# EAGLE design rfm_dil_adapter (EAGLE 6.6.0)
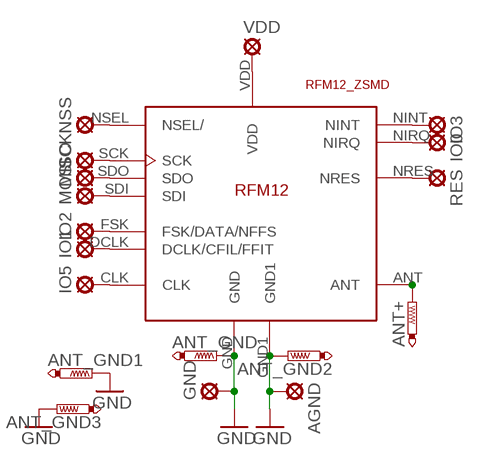
[diagram p0: schematic, sheet 1]

## Parts
AGND  LSP10  [LSP10]
ANT+  PTR1TP20SQ  [TP20SQ]
ANT_GND  PTR1TP20SQ  [TP20SQ]
ANT_GND1  PTR1TP20SQ  [TP20SQ]
ANT_GND2  PTR1TP20SQ  [TP20SQ]
ANT_GND3  PTR1TP20SQ  [TP20SQ]
GND  LSP10  [LSP10]
IO0  LSP10  [LSP10]
IO1  LSP10  [LSP10]
IO2  LSP10  [LSP10]
IO3  LSP10  [LSP10]
IO5  LSP10  [LSP10]
MISO  LSP10  [LSP10]
MOSI  LSP10  [LSP10]
NSS  LSP10  [LSP10]
RES  LSP10  [LSP10]
SCK  LSP10  [LSP10]
U$1  RFM12_ZSMD  [RFM12_Z]
VDD  LSP10  [LSP10]

## Nets
ANT: ANT+.TP U$1.ANT
GND: AGND.MP ANT_GND1.TP ANT_GND2.TP ANT_GND3.TP ANT_GND.TP GND.MP U$1.GND U$1.GND1
N$1: IO5.MP U$1.CLK
N$2: IO1.MP U$1.DCLK(DCLK/CFIL/FFIT)
N$3: IO2.MP U$1.FSK(FSK/DATA/NFFS)
N$4: MOSI.MP U$1.SDI
N$5: MISO.MP U$1.SDO
N$6: SCK.MP U$1.SCK
N$7: NSS.MP U$1.NSEL(NSEL/)
N$11: RES.MP U$1.NRES
N$12: IO0.MP U$1.NIRQ
N$13: IO3.MP U$1.NINT
VDD: U$1.VDD VDD.MP

## Library data of the parts
AGND GND IO0 IO1-IO3 IO5 MISO MOSI NSS RES SCK VDD = solpad:LSP10: SOLDER PAD drill 1.0 mm, distributor Buerklin, 12H555
ANT+ ANT_GND ANT_GND1-ANT_GND3 = testpad:PTR1: TEST PIN
U$1 = fp:RFM12_Z

## Board
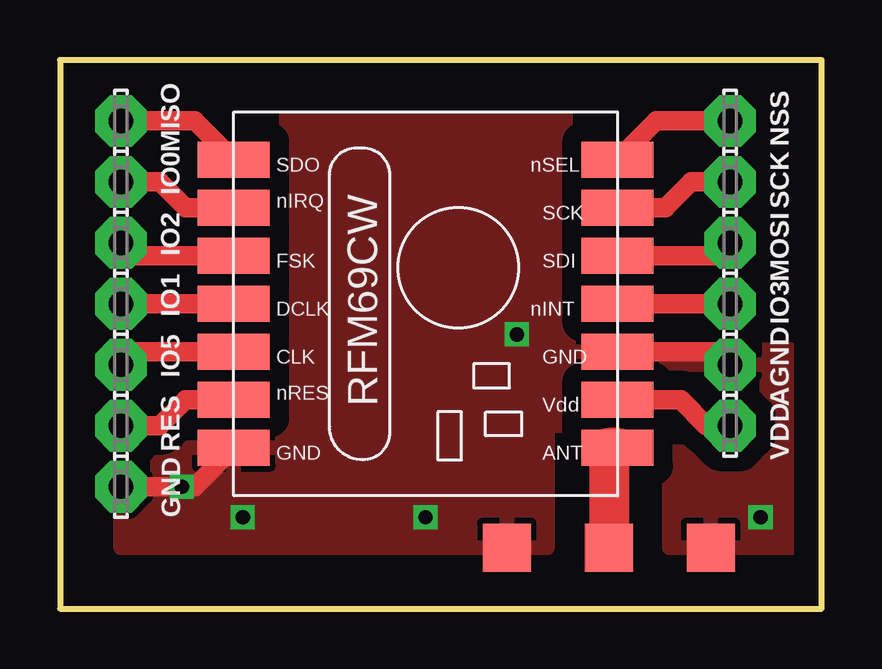
[diagram p1: board, top side]
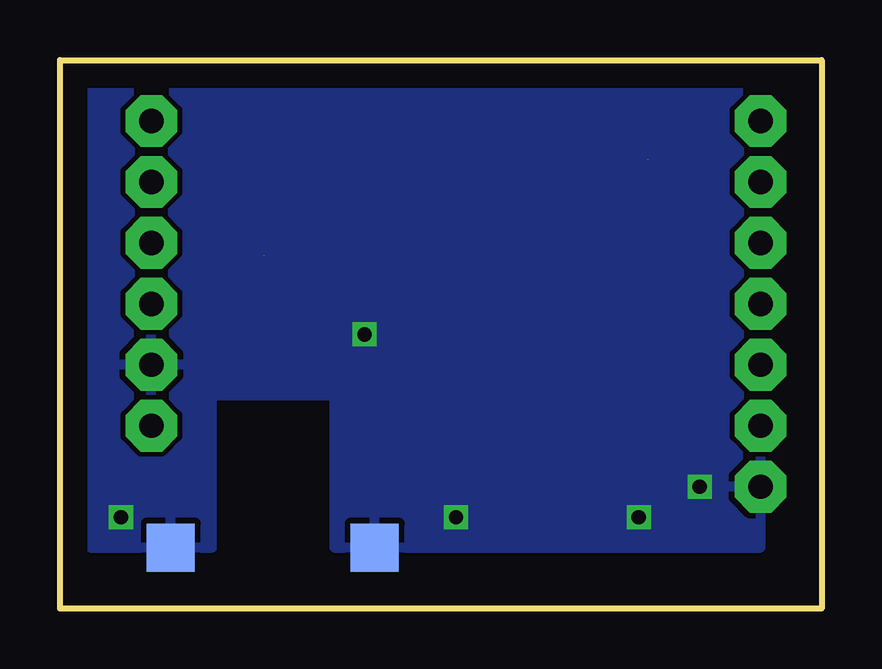
[diagram p2: board, bottom side, seen from below]

Size 31.75 x 22.86 mm. Coordinates in mm from the lower left corner, seen from the top.
Outline: 0,22.86 0,0 31.75,0 31.75,22.86 0,22.86
Copper layers (1*16): Top 0.035mm / dielectric 1.5mm / Bottom 0.035mm
Design rules "default": minimum track width 10mil, minimum drill 24mil, track to track 8mil, track to pad 8mil, pad to pad 8mil, via to via 8mil, smd to smd 8mil, copper to edge 40mil, drill to drill 8mil, minimum pad ring 10mil, minimum via ring 8mil, stop-mask expansion 4mil, vias tented up to drill 0mil, thermal gap 10mil

### Footprints (pad centres in the part's own frame; a part is rotated, then mirrored left to right if it is on the bottom)
LSP10 = drill 1.016 pad 2.159 octagon: MP 0,0
TP20SQ = smd 2 x 2: TP 0,0
RFM12_Z = smd 1.5 x 3: ANT 6,8; CLK 2,-8; DCLK 0,-8; FSK -2,-8; GND 6,-8; GND1 2,8; NINT 0,8; NIRQ -4,-8; NRES 4,-8; NSEL -6,8; SCK -4,8; SDI -2,8; SDO -6,-8; VDD 4,8

### Placement (x,y rotation side)
AGND  27.94,10.16 270 top
ANT+  22.89,2.54 0 top
ANT_GND  18.64,2.54 0 top
ANT_GND1  18.64,2.54 0 bottom
ANT_GND2  27.14,2.54 0 top
ANT_GND3  27.14,2.54 0 bottom
GND  2.54,5.08 270 top
IO0  2.54,17.78 270 top
IO1  2.54,12.7 270 top
IO2  2.54,15.24 270 top
IO3  27.94,12.7 270 top
IO5  2.54,10.16 270 top
MISO  2.54,20.32 270 top
MOSI  27.94,15.24 270 top
NSS  27.94,20.32 270 top
RES  2.54,7.62 270 top
SCK  27.94,17.78 270 top
U$1  15.24,12.7 270 top
VDD  27.94,7.62 270 top

### Tracks (layer width: path | path; a pad name or v marks a point on that pad's centre or on a via)
ANT
  Top 1.676: U$1.ANT 22.89,6.7 ANT+.TP
GND  (via drill 0.6)
  Top 0.813: GND.MP 5.62,5.08 U$1.GND | AGND.MP 27.4,10.7 U$1.GND1
  other vias: 7.62,3.81 15.24,3.81 29.21,3.81 5.08,5.08 19.05,11.43
  pour Top (isolate 0.813): 2.54,20.32 22.86,20.32 22.86,10.79 30.48,10.79 30.48,2.54 25.4,2.54 25.4,7.62 20.32,7.62 20.32,2.54 2.54,2.54
  pour Bottom: 2.54,2.54 2.54,21.59 30.48,21.59 30.48,2.54 25.4,2.54 25.4,8.89 20.32,8.89 20.32,2.54
N$1
  Top 0.813: IO5.MP 3.08,10.7 U$1.CLK
N$2
  Top 0.813: IO1.MP U$1.DCLK
N$3
  Top 0.813: IO2.MP 3.08,14.7 U$1.FSK
N$4  (1 unrouted)
  Top 0.813: MOSI.MP 27.4,14.7 U$1.SDI
N$5  (1 unrouted)
  Top 0.813: MISO.MP 5.62,20.32 U$1.SDO
N$6
  Top 0.813: SCK.MP 26.32,17.78 25.24,16.7 U$1.SCK | U$1.SCK
N$7
  Top 0.813: NSS.MP 24.86,20.32 U$1.NSEL
N$11
  Top 0.813: RES.MP 4.16,7.62 5.24,8.7 U$1.NRES | U$1.NRES
N$12
  Top 0.813: IO0.MP 4.16,17.78 5.24,16.7 U$1.NIRQ | U$1.NIRQ
N$13
  Top 0.813: IO3.MP U$1.NINT
VDD
  Top 0.813: VDD.MP 26.95,7.62 25.88,8.7 U$1.VDD | U$1.VDD